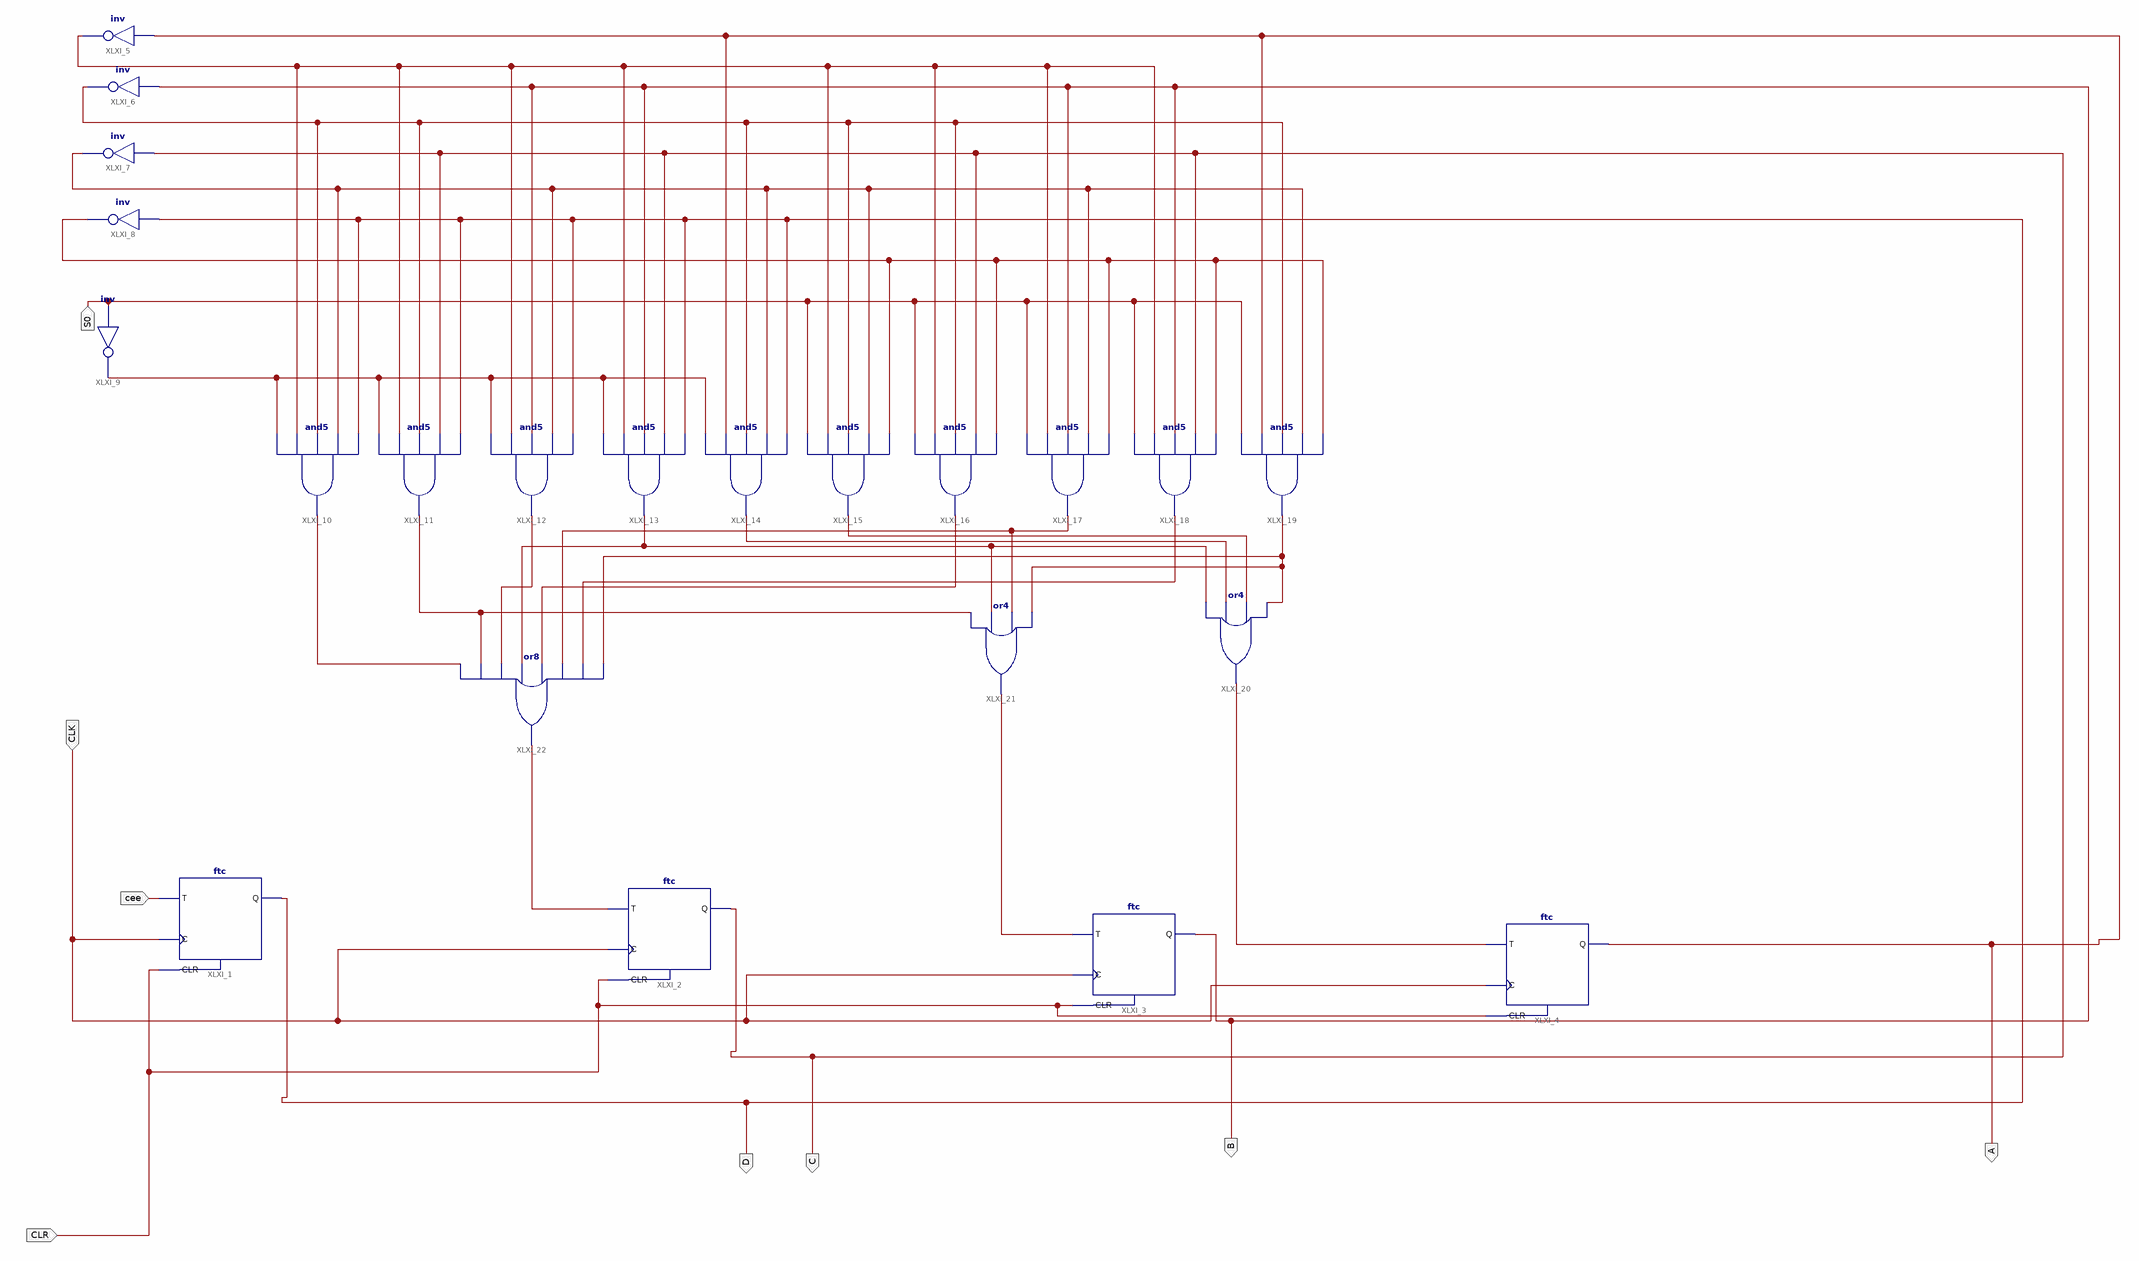
[diagram p0: schematic sheet 1]
// Xilinx ISE schematic ripple0_9.sch (spartan6) as structural Verilog: 22 symbols, 8 ports
module ripple0_9 (
  input  S0,
  input  CLK,
  input  CLR,
  input  cee,
  output A,
  output B,
  output C,
  output D
);

  wire XLXN_12, XLXN_14, XLXN_16, XLXN_17, XLXN_20, XLXN_60, XLXN_61, XLXN_62, XLXN_64, XLXN_66, XLXN_67,
       XLXN_68, XLXN_69, XLXN_70, XLXN_71, XLXN_72, XLXN_73, XLXN_74;

  ftc XLXI_1 (.C(CLK), .CLR(CLR), .T(cee), .Q(D));
  ftc XLXI_2 (.C(CLK), .CLR(CLR), .T(XLXN_62), .Q(C));
  ftc XLXI_3 (.C(CLK), .CLR(CLR), .T(XLXN_61), .Q(B));
  ftc XLXI_4 (.C(CLK), .CLR(CLR), .T(XLXN_60), .Q(A));
  not XLXI_5 (XLXN_12, A);
  not XLXI_6 (XLXN_14, B);
  not XLXI_7 (XLXN_16, C);
  not XLXI_8 (XLXN_17, D);
  not XLXI_9 (XLXN_20, S0);
  and XLXI_10 (XLXN_71, XLXN_20, XLXN_12, XLXN_14, XLXN_16, D);
  and XLXI_11 (XLXN_69, XLXN_20, XLXN_12, XLXN_14, C, D);
  and XLXI_12 (XLXN_72, XLXN_20, XLXN_12, B, XLXN_16, D);
  and XLXI_13 (XLXN_64, XLXN_20, XLXN_12, B, C, D);
  and XLXI_14 (XLXN_66, XLXN_20, A, XLXN_14, XLXN_16, D);
  and XLXI_15 (XLXN_67, S0, XLXN_12, XLXN_14, XLXN_16, XLXN_17);
  and XLXI_16 (XLXN_73, S0, XLXN_12, XLXN_14, C, XLXN_17);
  and XLXI_17 (XLXN_70, S0, XLXN_12, B, XLXN_16, XLXN_17);
  and XLXI_18 (XLXN_74, S0, XLXN_12, B, C, XLXN_17);
  and XLXI_19 (XLXN_68, S0, A, XLXN_14, XLXN_16, XLXN_17);
  or XLXI_20 (XLXN_60, XLXN_64, XLXN_66, XLXN_67, XLXN_68);
  or XLXI_21 (XLXN_61, XLXN_69, XLXN_64, XLXN_70, XLXN_68);
  or XLXI_22 (XLXN_62, XLXN_71, XLXN_69, XLXN_72, XLXN_64, XLXN_73, XLXN_70, XLXN_74, XLXN_68);
endmodule
